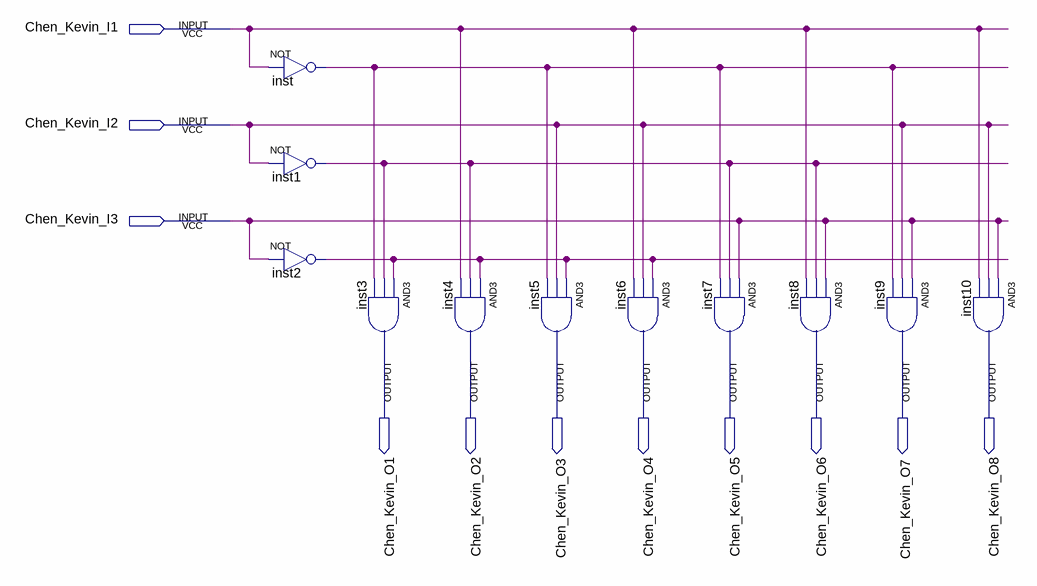
[diagram p0: schematic sheet]
// Quartus schematic Chen_Kevin_3To8Decoder.bdf as structural Verilog: 11 symbols, 11 pins
module Chen_Kevin_3To8Decoder (
  input  Chen_Kevin_I1,
  input  Chen_Kevin_I2,
  input  Chen_Kevin_I3,
  output Chen_Kevin_O1,
  output Chen_Kevin_O2,
  output Chen_Kevin_O3,
  output Chen_Kevin_O4,
  output Chen_Kevin_O5,
  output Chen_Kevin_O6,
  output Chen_Kevin_O7,
  output Chen_Kevin_O8
);

  wire inst1_out, inst2_out, inst_out;

  not inst (inst_out, Chen_Kevin_I1);
  not inst1 (inst1_out, Chen_Kevin_I2);
  not inst2 (inst2_out, Chen_Kevin_I3);
  and inst3 (Chen_Kevin_O1, inst2_out, inst1_out, inst_out);
  and inst4 (Chen_Kevin_O2, inst2_out, inst1_out, Chen_Kevin_I1);
  and inst5 (Chen_Kevin_O3, inst2_out, Chen_Kevin_I2, inst_out);
  and inst6 (Chen_Kevin_O4, inst2_out, Chen_Kevin_I2, Chen_Kevin_I1);
  and inst7 (Chen_Kevin_O5, Chen_Kevin_I3, inst1_out, inst_out);
  and inst8 (Chen_Kevin_O6, Chen_Kevin_I3, inst1_out, Chen_Kevin_I1);
  and inst9 (Chen_Kevin_O7, Chen_Kevin_I3, Chen_Kevin_I2, inst_out);
  and inst10 (Chen_Kevin_O8, Chen_Kevin_I3, Chen_Kevin_I2, Chen_Kevin_I1);
endmodule
